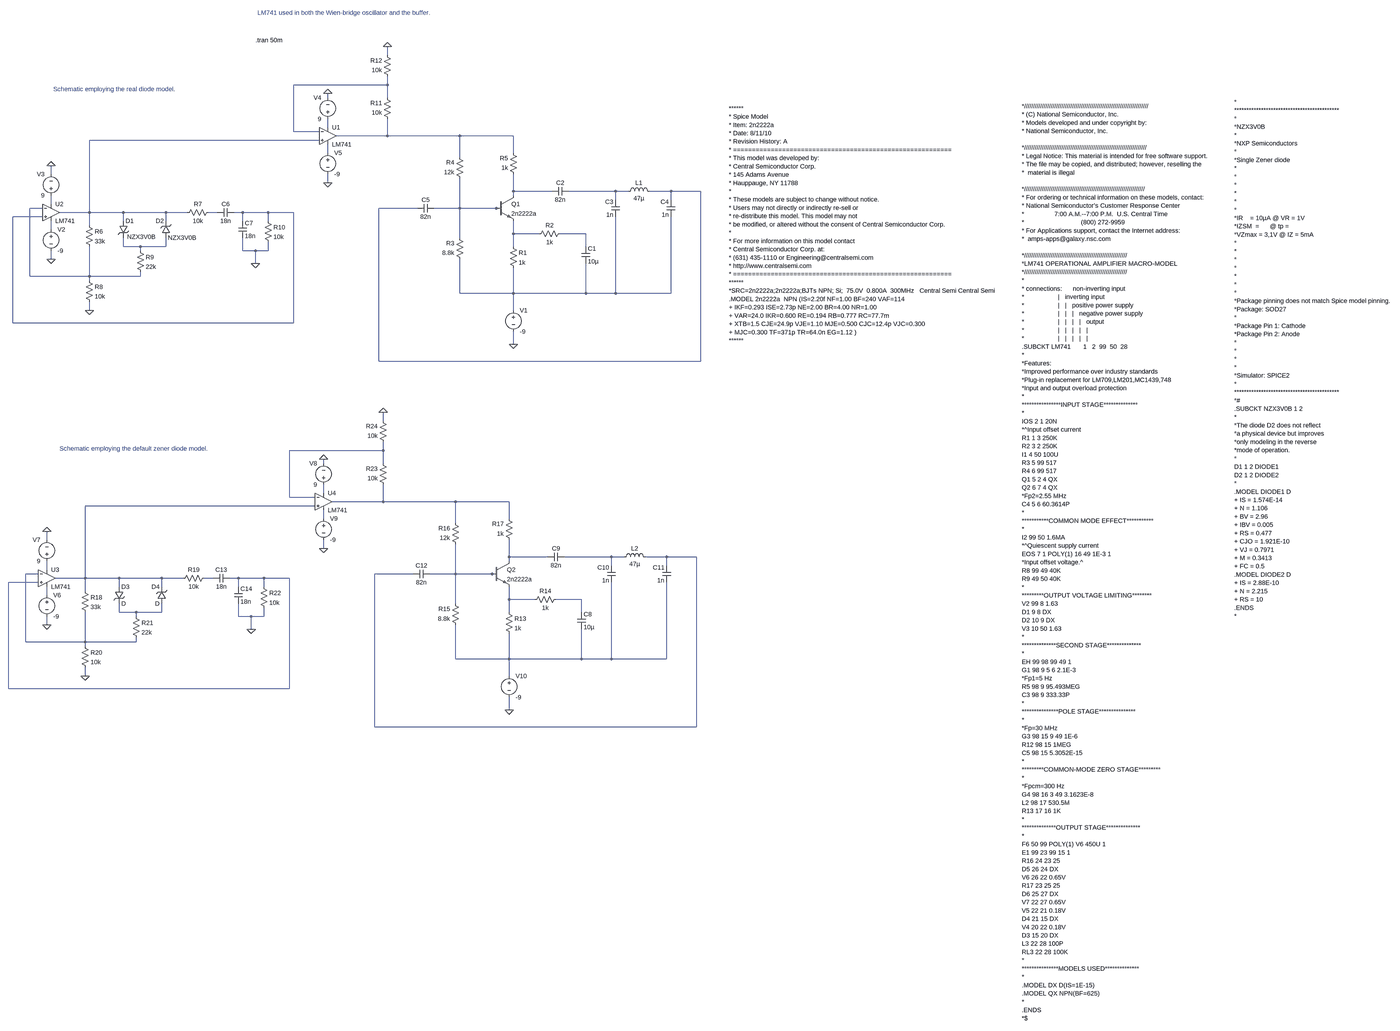
[diagram p0: schematic modulator.asc, whole sheet]
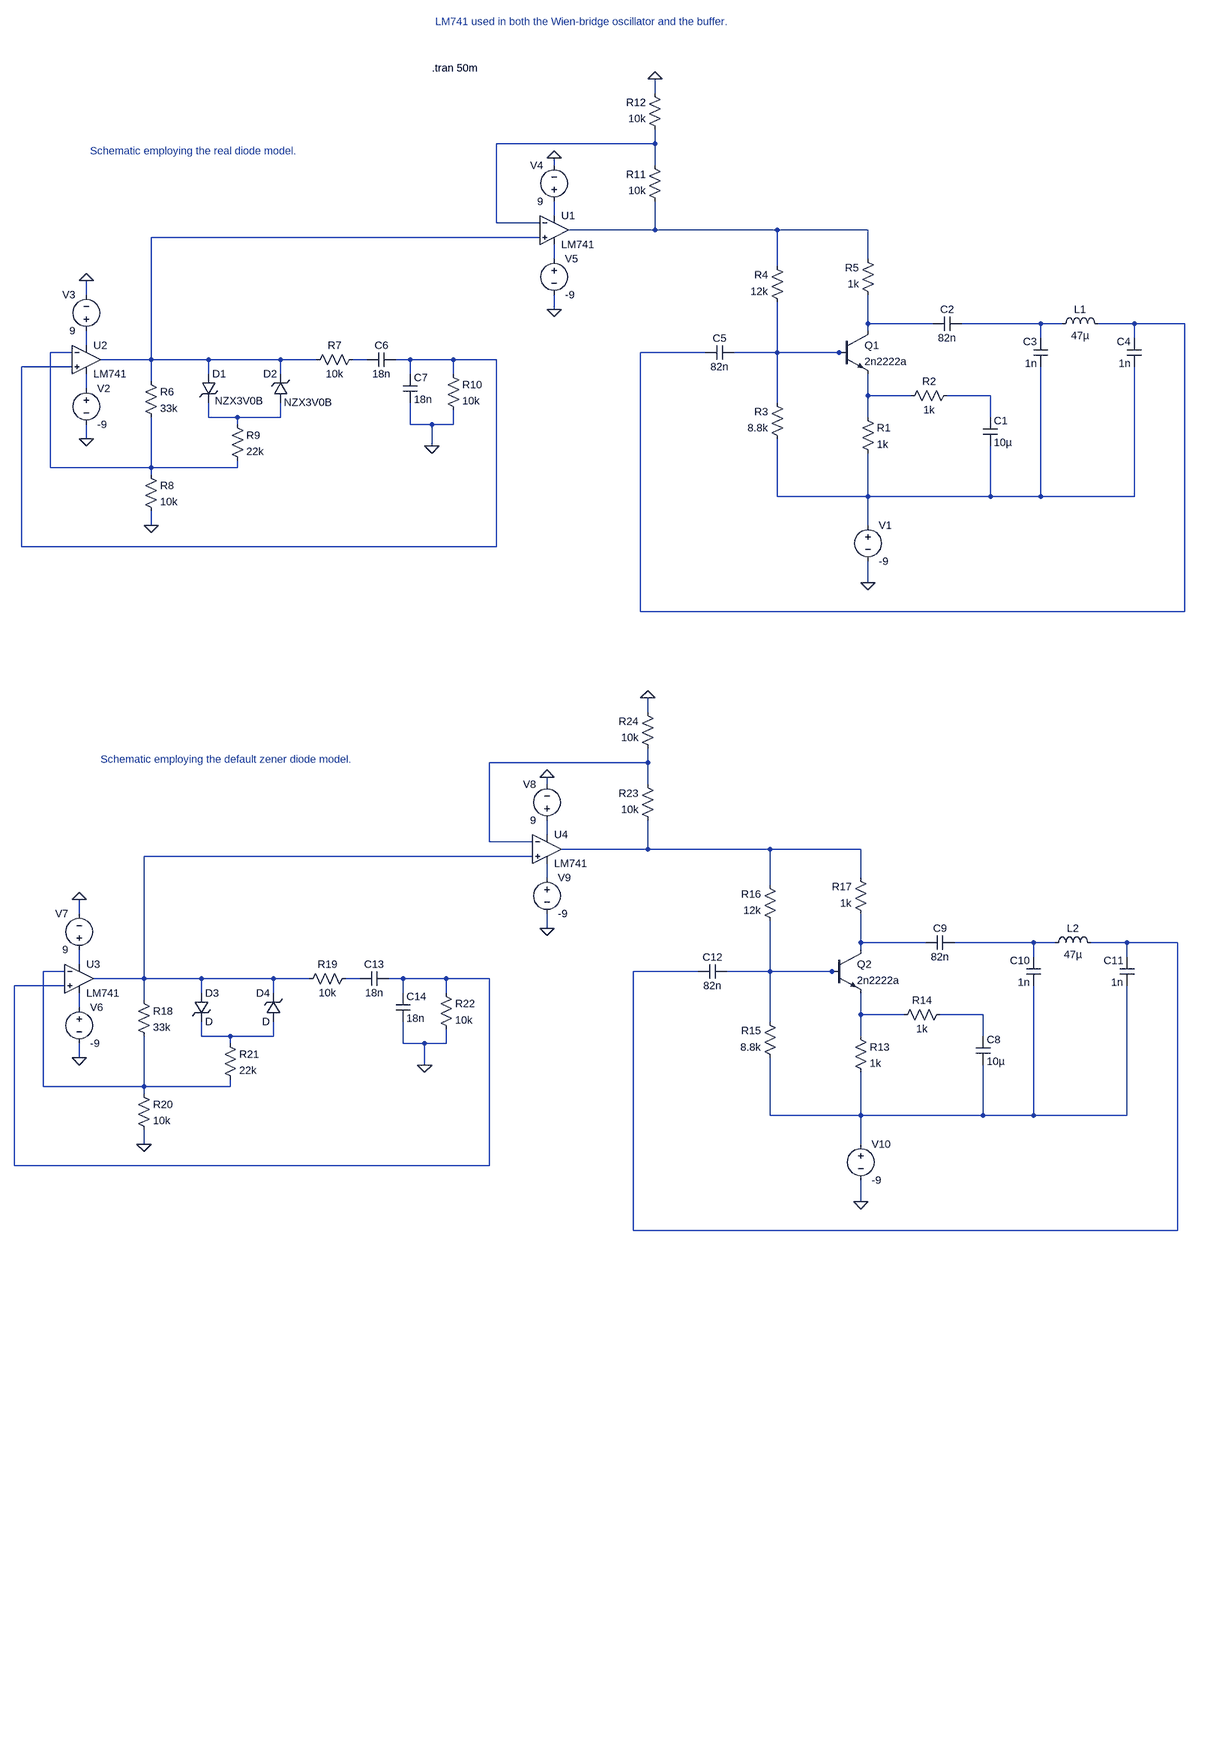
[diagram p1: schematic modulator.asc, part, row 1 of 1, column 1 of 2]
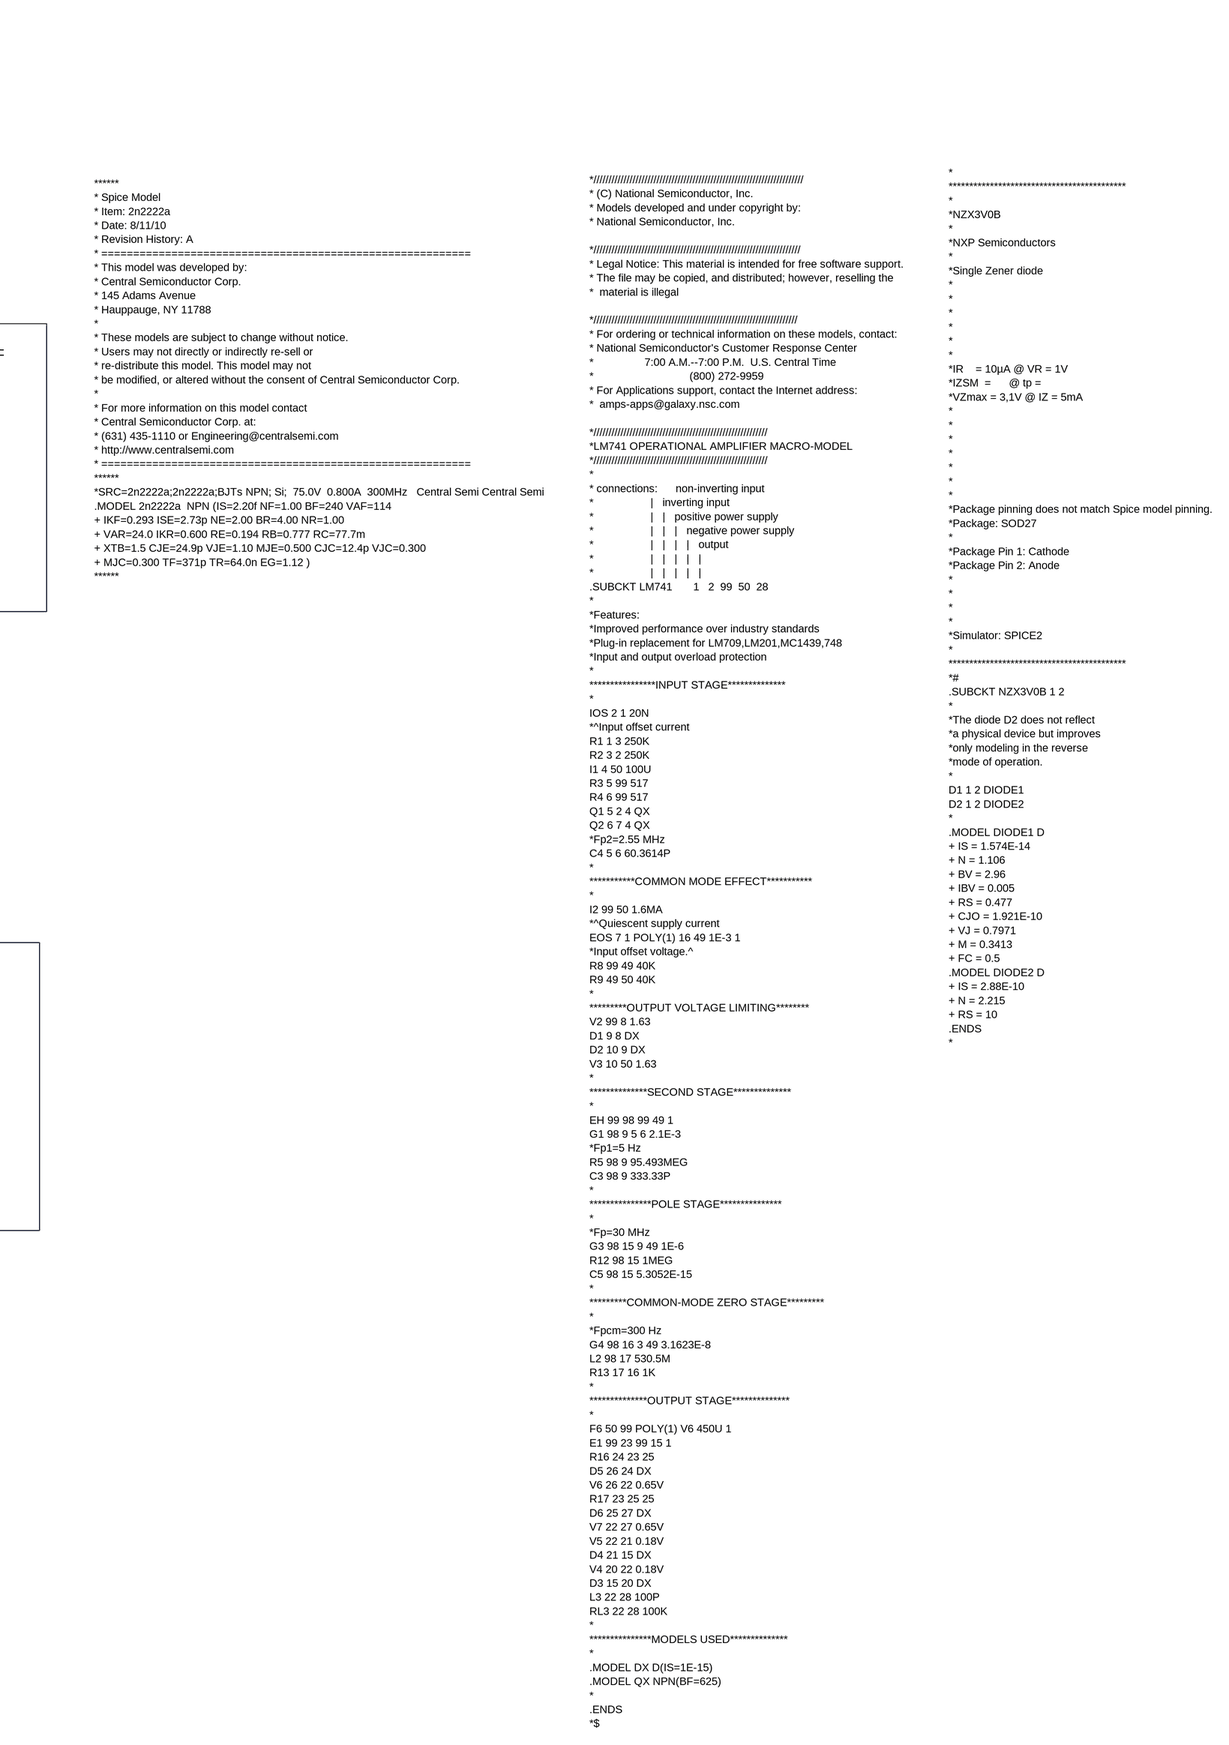
[diagram p2: schematic modulator.asc, part, row 1 of 1, column 2 of 2]
modulator.asc, the LTspice schematic file:
Version 4
SHEET 1 3220 3080
WIRE -1600 -208 -1600 -240
WIRE -1600 -96 -1600 -128
WIRE -1600 -96 -1952 -96
WIRE -1824 -48 -1824 -64
WIRE -1600 -48 -1600 -96
WIRE -1824 64 -1824 32
WIRE -1952 80 -1952 -96
WIRE -1856 80 -1952 80
WIRE -1600 96 -1600 32
WIRE -1600 96 -1792 96
WIRE -1328 96 -1600 96
WIRE -1088 96 -1328 96
WIRE -1856 112 -2720 112
WIRE -1824 160 -1824 128
WIRE -1088 160 -1088 96
WIRE -1328 176 -1328 96
WIRE -2864 240 -2864 208
WIRE -1824 272 -1824 240
WIRE -1088 304 -1088 240
WIRE -944 304 -1088 304
WIRE -704 304 -880 304
WIRE -656 304 -704 304
WIRE -496 304 -576 304
WIRE -384 304 -496 304
WIRE -1088 320 -1088 304
WIRE -704 336 -704 304
WIRE -496 336 -496 304
WIRE -2864 352 -2864 320
WIRE -2896 368 -2944 368
WIRE -1488 368 -1632 368
WIRE -1328 368 -1328 256
WIRE -1328 368 -1424 368
WIRE -1152 368 -1328 368
WIRE -1136 368 -1152 368
WIRE -2720 384 -2720 112
WIRE -2720 384 -2832 384
WIRE -2592 384 -2720 384
WIRE -2432 384 -2592 384
WIRE -2352 384 -2432 384
WIRE -2240 384 -2272 384
WIRE -2144 384 -2176 384
WIRE -2048 384 -2144 384
WIRE -1952 384 -2048 384
WIRE -2896 400 -3008 400
WIRE -2592 416 -2592 384
WIRE -2432 416 -2432 384
WIRE -2144 416 -2144 384
WIRE -2048 416 -2048 384
WIRE -2720 432 -2720 384
WIRE -2864 448 -2864 416
WIRE -1088 464 -1088 416
WIRE -992 464 -1088 464
WIRE -816 464 -912 464
WIRE -1328 480 -1328 368
WIRE -2592 512 -2592 480
WIRE -2528 512 -2592 512
WIRE -2432 512 -2432 480
WIRE -2432 512 -2528 512
WIRE -1088 512 -1088 464
WIRE -816 512 -816 464
WIRE -2528 528 -2528 512
WIRE -2144 528 -2144 480
WIRE -2096 528 -2144 528
WIRE -2048 528 -2048 496
WIRE -2048 528 -2096 528
WIRE -2864 560 -2864 528
WIRE -2096 576 -2096 528
WIRE -2944 624 -2944 368
WIRE -2720 624 -2720 512
WIRE -2720 624 -2944 624
WIRE -2528 624 -2528 608
WIRE -2528 624 -2720 624
WIRE -2720 640 -2720 624
WIRE -1328 688 -1328 560
WIRE -1088 688 -1088 592
WIRE -1088 688 -1328 688
WIRE -816 688 -816 576
WIRE -816 688 -1088 688
WIRE -704 688 -704 400
WIRE -704 688 -816 688
WIRE -496 688 -496 400
WIRE -496 688 -704 688
WIRE -2720 752 -2720 720
WIRE -1088 752 -1088 688
WIRE -3008 800 -3008 400
WIRE -1952 800 -1952 384
WIRE -1952 800 -3008 800
WIRE -1088 880 -1088 832
WIRE -1632 944 -1632 368
WIRE -384 944 -384 304
WIRE -384 944 -1632 944
WIRE -1616 1168 -1616 1136
WIRE -1616 1280 -1616 1248
WIRE -1616 1280 -1968 1280
WIRE -1840 1328 -1840 1312
WIRE -1616 1328 -1616 1280
WIRE -1840 1440 -1840 1408
WIRE -1968 1456 -1968 1280
WIRE -1872 1456 -1968 1456
WIRE -1616 1472 -1616 1408
WIRE -1616 1472 -1808 1472
WIRE -1344 1472 -1616 1472
WIRE -1104 1472 -1344 1472
WIRE -1872 1488 -2736 1488
WIRE -1840 1536 -1840 1504
WIRE -1104 1536 -1104 1472
WIRE -1344 1552 -1344 1472
WIRE -2880 1616 -2880 1584
WIRE -1840 1648 -1840 1616
WIRE -1104 1680 -1104 1616
WIRE -960 1680 -1104 1680
WIRE -720 1680 -896 1680
WIRE -672 1680 -720 1680
WIRE -512 1680 -592 1680
WIRE -400 1680 -512 1680
WIRE -1104 1696 -1104 1680
WIRE -720 1712 -720 1680
WIRE -512 1712 -512 1680
WIRE -2880 1728 -2880 1696
WIRE -2912 1744 -2960 1744
WIRE -1504 1744 -1648 1744
WIRE -1344 1744 -1344 1632
WIRE -1344 1744 -1440 1744
WIRE -1168 1744 -1344 1744
WIRE -1152 1744 -1168 1744
WIRE -2736 1760 -2736 1488
WIRE -2736 1760 -2848 1760
WIRE -2608 1760 -2736 1760
WIRE -2448 1760 -2608 1760
WIRE -2368 1760 -2448 1760
WIRE -2256 1760 -2288 1760
WIRE -2160 1760 -2192 1760
WIRE -2064 1760 -2160 1760
WIRE -1968 1760 -2064 1760
WIRE -2912 1776 -3024 1776
WIRE -2608 1792 -2608 1760
WIRE -2448 1792 -2448 1760
WIRE -2160 1792 -2160 1760
WIRE -2064 1792 -2064 1760
WIRE -2736 1808 -2736 1760
WIRE -2880 1824 -2880 1792
WIRE -1104 1840 -1104 1792
WIRE -1008 1840 -1104 1840
WIRE -832 1840 -928 1840
WIRE -1344 1856 -1344 1744
WIRE -2608 1888 -2608 1856
WIRE -2544 1888 -2608 1888
WIRE -2448 1888 -2448 1856
WIRE -2448 1888 -2544 1888
WIRE -1104 1888 -1104 1840
WIRE -832 1888 -832 1840
WIRE -2544 1904 -2544 1888
WIRE -2160 1904 -2160 1856
WIRE -2112 1904 -2160 1904
WIRE -2064 1904 -2064 1872
WIRE -2064 1904 -2112 1904
WIRE -2880 1936 -2880 1904
WIRE -2112 1952 -2112 1904
WIRE -2960 2000 -2960 1744
WIRE -2736 2000 -2736 1888
WIRE -2736 2000 -2960 2000
WIRE -2544 2000 -2544 1984
WIRE -2544 2000 -2736 2000
WIRE -2736 2016 -2736 2000
WIRE -1344 2064 -1344 1936
WIRE -1104 2064 -1104 1968
WIRE -1104 2064 -1344 2064
WIRE -832 2064 -832 1952
WIRE -832 2064 -1104 2064
WIRE -720 2064 -720 1776
WIRE -720 2064 -832 2064
WIRE -512 2064 -512 1776
WIRE -512 2064 -720 2064
WIRE -2736 2128 -2736 2096
WIRE -1104 2128 -1104 2064
WIRE -3024 2176 -3024 1776
WIRE -1968 2176 -1968 1760
WIRE -1968 2176 -3024 2176
WIRE -1104 2256 -1104 2208
WIRE -1648 2320 -1648 1744
WIRE -400 2320 -400 1680
WIRE -400 2320 -1648 2320
FLAG -2720 752 0
FLAG -2096 576 0
FLAG -2864 560 0
FLAG -2864 208 0
FLAG -1600 -240 0
FLAG -1824 -64 0
FLAG -1824 272 0
FLAG -1088 880 0
FLAG -2736 2128 0
FLAG -2112 1952 0
FLAG -2880 1936 0
FLAG -2880 1584 0
FLAG -1616 1136 0
FLAG -1840 1312 0
FLAG -1840 1648 0
FLAG -1104 2256 0
SYMBOL npn -1152 320 R0
SYMATTR InstName Q1
SYMATTR Value 2n2222a
SYMBOL res -1104 496 R0
SYMATTR InstName R1
SYMATTR Value 1k
SYMBOL res -896 448 R90
WINDOW 0 0 56 VBottom 2
WINDOW 3 32 56 VTop 2
SYMATTR InstName R2
SYMATTR Value 1k
SYMBOL res -1312 576 R180
WINDOW 0 36 76 Left 2
WINDOW 3 36 40 Left 2
SYMATTR InstName R3
SYMATTR Value 8.8k
SYMBOL res -1312 272 R180
WINDOW 0 36 76 Left 2
WINDOW 3 36 40 Left 2
SYMATTR InstName R4
SYMATTR Value 12k
SYMBOL res -1072 256 R180
WINDOW 0 36 76 Left 2
WINDOW 3 36 40 Left 2
SYMATTR InstName R5
SYMATTR Value 1k
SYMBOL cap -832 512 R0
SYMATTR InstName C1
SYMATTR Value 10µ
SYMBOL cap -880 288 R90
WINDOW 0 0 32 VBottom 2
WINDOW 3 32 32 VTop 2
SYMATTR InstName C2
SYMATTR Value 82n
SYMBOL cap -688 400 R180
WINDOW 0 24 56 Left 2
WINDOW 3 24 8 Left 2
SYMATTR InstName C3
SYMATTR Value 1n
SYMBOL cap -480 400 R180
WINDOW 0 24 56 Left 2
WINDOW 3 24 8 Left 2
SYMATTR InstName C4
SYMATTR Value 1n
SYMBOL cap -1488 384 R270
WINDOW 0 32 32 VTop 2
WINDOW 3 0 32 VBottom 2
SYMATTR InstName C5
SYMATTR Value 82n
SYMBOL ind -672 320 R270
WINDOW 0 32 56 VTop 2
WINDOW 3 5 56 VBottom 2
SYMATTR InstName L1
SYMATTR Value 47µ
SYMBOL OpAmps\\opamp2 -2864 320 R0
SYMATTR InstName U2
SYMATTR Value LM741
SYMBOL res -2736 416 R0
SYMATTR InstName R6
SYMATTR Value 33k
SYMBOL res -2256 368 R90
WINDOW 0 0 56 VBottom 2
WINDOW 3 32 56 VTop 2
SYMATTR InstName R7
SYMATTR Value 10k
SYMBOL res -2736 624 R0
SYMATTR InstName R8
SYMATTR Value 10k
SYMBOL res -2544 512 R0
SYMATTR InstName R9
SYMATTR Value 22k
SYMBOL zener -2608 416 R0
WINDOW 3 30 60 Left 2
SYMATTR InstName D1
SYMATTR Value NZX3V0B
SYMATTR Prefix X
SYMBOL zener -2416 480 R180
WINDOW 0 24 64 Left 2
WINDOW 3 -98 1 Left 2
SYMATTR InstName D2
SYMATTR Value NZX3V0B
SYMATTR Prefix X
SYMBOL cap -2176 368 R90
WINDOW 0 0 32 VBottom 2
WINDOW 3 32 32 VTop 2
SYMATTR InstName C6
SYMATTR Value 18n
SYMBOL cap -2160 416 R0
SYMATTR InstName C7
SYMATTR Value 18n
SYMBOL res -2064 400 R0
SYMATTR InstName R10
SYMATTR Value 10k
SYMBOL voltage -2864 432 R0
SYMATTR InstName V2
SYMATTR Value -9
SYMBOL voltage -2864 336 R180
WINDOW 0 24 96 Left 2
WINDOW 3 24 16 Left 2
SYMATTR InstName V3
SYMATTR Value 9
SYMBOL OpAmps\\opamp2 -1824 32 R0
SYMATTR InstName U1
SYMATTR Value LM741
SYMBOL res -1584 48 R180
WINDOW 0 36 76 Left 2
WINDOW 3 36 40 Left 2
SYMATTR InstName R11
SYMATTR Value 10k
SYMBOL res -1584 -112 R180
WINDOW 0 36 76 Left 2
WINDOW 3 36 40 Left 2
SYMATTR InstName R12
SYMATTR Value 10k
SYMBOL voltage -1824 48 R180
WINDOW 0 24 96 Left 2
WINDOW 3 24 16 Left 2
SYMATTR InstName V4
SYMATTR Value 9
SYMBOL voltage -1824 144 R0
SYMATTR InstName V5
SYMATTR Value -9
SYMBOL voltage -1088 736 R0
SYMATTR InstName V1
SYMATTR Value -9
SYMBOL npn -1168 1696 R0
SYMATTR InstName Q2
SYMATTR Value 2n2222a
SYMBOL res -1120 1872 R0
SYMATTR InstName R13
SYMATTR Value 1k
SYMBOL res -912 1824 R90
WINDOW 0 0 56 VBottom 2
WINDOW 3 32 56 VTop 2
SYMATTR InstName R14
SYMATTR Value 1k
SYMBOL res -1328 1952 R180
WINDOW 0 36 76 Left 2
WINDOW 3 36 40 Left 2
SYMATTR InstName R15
SYMATTR Value 8.8k
SYMBOL res -1328 1648 R180
WINDOW 0 36 76 Left 2
WINDOW 3 36 40 Left 2
SYMATTR InstName R16
SYMATTR Value 12k
SYMBOL res -1088 1632 R180
WINDOW 0 36 76 Left 2
WINDOW 3 36 40 Left 2
SYMATTR InstName R17
SYMATTR Value 1k
SYMBOL cap -848 1888 R0
SYMATTR InstName C8
SYMATTR Value 10µ
SYMBOL cap -896 1664 R90
WINDOW 0 0 32 VBottom 2
WINDOW 3 32 32 VTop 2
SYMATTR InstName C9
SYMATTR Value 82n
SYMBOL cap -704 1776 R180
WINDOW 0 24 56 Left 2
WINDOW 3 24 8 Left 2
SYMATTR InstName C10
SYMATTR Value 1n
SYMBOL cap -496 1776 R180
WINDOW 0 24 56 Left 2
WINDOW 3 24 8 Left 2
SYMATTR InstName C11
SYMATTR Value 1n
SYMBOL cap -1504 1760 R270
WINDOW 0 32 32 VTop 2
WINDOW 3 0 32 VBottom 2
SYMATTR InstName C12
SYMATTR Value 82n
SYMBOL ind -688 1696 R270
WINDOW 0 32 56 VTop 2
WINDOW 3 5 56 VBottom 2
SYMATTR InstName L2
SYMATTR Value 47µ
SYMBOL OpAmps\\opamp2 -2880 1696 R0
SYMATTR InstName U3
SYMATTR Value LM741
SYMBOL res -2752 1792 R0
SYMATTR InstName R18
SYMATTR Value 33k
SYMBOL res -2272 1744 R90
WINDOW 0 0 56 VBottom 2
WINDOW 3 32 56 VTop 2
SYMATTR InstName R19
SYMATTR Value 10k
SYMBOL res -2752 2000 R0
SYMATTR InstName R20
SYMATTR Value 10k
SYMBOL res -2560 1888 R0
SYMATTR InstName R21
SYMATTR Value 22k
SYMBOL cap -2192 1744 R90
WINDOW 0 0 32 VBottom 2
WINDOW 3 32 32 VTop 2
SYMATTR InstName C13
SYMATTR Value 18n
SYMBOL cap -2176 1792 R0
SYMATTR InstName C14
SYMATTR Value 18n
SYMBOL res -2080 1776 R0
SYMATTR InstName R22
SYMATTR Value 10k
SYMBOL voltage -2880 1808 R0
SYMATTR InstName V6
SYMATTR Value -9
SYMBOL voltage -2880 1712 R180
WINDOW 0 24 96 Left 2
WINDOW 3 24 16 Left 2
SYMATTR InstName V7
SYMATTR Value 9
SYMBOL OpAmps\\opamp2 -1840 1408 R0
SYMATTR InstName U4
SYMATTR Value LM741
SYMBOL res -1600 1424 R180
WINDOW 0 36 76 Left 2
WINDOW 3 36 40 Left 2
SYMATTR InstName R23
SYMATTR Value 10k
SYMBOL res -1600 1264 R180
WINDOW 0 36 76 Left 2
WINDOW 3 36 40 Left 2
SYMATTR InstName R24
SYMATTR Value 10k
SYMBOL voltage -1840 1424 R180
WINDOW 0 24 96 Left 2
WINDOW 3 24 16 Left 2
SYMATTR InstName V8
SYMATTR Value 9
SYMBOL voltage -1840 1520 R0
SYMATTR InstName V9
SYMATTR Value -9
SYMBOL voltage -1104 2112 R0
SYMATTR InstName V10
SYMATTR Value -9
SYMBOL zener -2624 1792 R0
SYMATTR InstName D3
SYMBOL zener -2432 1856 R180
WINDOW 0 24 64 Left 2
WINDOW 3 24 0 Left 2
SYMATTR InstName D4
TEXT 320 -8 Left 2 !******\n* Spice Model\n* Item: 2n2222a\n* Date: 8/11/10\n* Revision History: A\n* ==========================================================\n* This model was developed by: \n* Central Semiconductor Corp.\n* 145 Adams Avenue\n* Hauppauge, NY 11788\n*\n* These models are subject to change without notice.\n* Users may not directly or indirectly re-sell or \n* re-distribute this model. This model may not \n* be modified, or altered without the consent of Central Semiconductor Corp. \n*\n* For more information on this model contact\n* Central Semiconductor Corp. at:\n* (631) 435-1110 or Engineering@centralsemi.com\n* http://www.centralsemi.com\n* ==========================================================\n******\n*SRC=2n2222a;2n2222a;BJTs NPN; Si;  75.0V  0.800A  300MHz   Central Semi Central Semi\n.MODEL 2n2222a  NPN (IS=2.20f NF=1.00 BF=240 VAF=114\n+ IKF=0.293 ISE=2.73p NE=2.00 BR=4.00 NR=1.00\n+ VAR=24.0 IKR=0.600 RE=0.194 RB=0.777 RC=77.7m\n+ XTB=1.5 CJE=24.9p VJE=1.10 MJE=0.500 CJC=12.4p VJC=0.300\n+ MJC=0.300 TF=371p TR=64.0n EG=1.12 )\n******
TEXT 1536 -16 Left 2 !*//////////////////////////////////////////////////////////////////////\n* (C) National Semiconductor, Inc.\n* Models developed and under copyright by:\n* National Semiconductor, Inc.  \n \n*/////////////////////////////////////////////////////////////////////\n* Legal Notice: This material is intended for free software support.\n* The file may be copied, and distributed; however, reselling the \n*  material is illegal\n \n*////////////////////////////////////////////////////////////////////\n* For ordering or technical information on these models, contact:\n* National Semiconductor's Customer Response Center\n*                 7:00 A.M.--7:00 P.M.  U.S. Central Time\n*                                (800) 272-9959\n* For Applications support, contact the Internet address:\n*  amps-apps@galaxy.nsc.com\n \n*//////////////////////////////////////////////////////////\n*LM741 OPERATIONAL AMPLIFIER MACRO-MODEL\n*//////////////////////////////////////////////////////////\n*\n* connections:      non-inverting input\n*                   |   inverting input\n*                   |   |   positive power supply\n*                   |   |   |   negative power supply\n*                   |   |   |   |   output\n*                   |   |   |   |   |\n*                   |   |   |   |   |\n.SUBCKT LM741       1   2  99  50  28\n*\n*Features:\n*Improved performance over industry standards\n*Plug-in replacement for LM709,LM201,MC1439,748\n*Input and output overload protection\n*\n****************INPUT STAGE**************\n*\nIOS 2 1 20N\n*^Input offset current\nR1 1 3 250K\nR2 3 2 250K\nI1 4 50 100U\nR3 5 99 517\nR4 6 99 517\nQ1 5 2 4 QX\nQ2 6 7 4 QX\n*Fp2=2.55 MHz\nC4 5 6 60.3614P\n*\n***********COMMON MODE EFFECT***********\n*\nI2 99 50 1.6MA\n*^Quiescent supply current\nEOS 7 1 POLY(1) 16 49 1E-3 1\n*Input offset voltage.^\nR8 99 49 40K\nR9 49 50 40K\n*\n*********OUTPUT VOLTAGE LIMITING********\nV2 99 8 1.63\nD1 9 8 DX\nD2 10 9 DX\nV3 10 50 1.63\n*\n**************SECOND STAGE**************\n*\nEH 99 98 99 49 1\nG1 98 9 5 6 2.1E-3\n*Fp1=5 Hz\nR5 98 9 95.493MEG\nC3 98 9 333.33P\n*\n***************POLE STAGE***************\n*\n*Fp=30 MHz\nG3 98 15 9 49 1E-6\nR12 98 15 1MEG\nC5 98 15 5.3052E-15\n*\n*********COMMON-MODE ZERO STAGE*********\n*\n*Fpcm=300 Hz\nG4 98 16 3 49 3.1623E-8\nL2 98 17 530.5M\nR13 17 16 1K\n*\n**************OUTPUT STAGE**************\n*\nF6 50 99 POLY(1) V6 450U 1\nE1 99 23 99 15 1\nR16 24 23 25\nD5 26 24 DX\nV6 26 22 0.65V\nR17 23 25 25\nD6 25 27 DX\nV7 22 27 0.65V\nV5 22 21 0.18V\nD4 21 15 DX\nV4 20 22 0.18V\nD3 15 20 DX\nL3 22 28 100P\nRL3 22 28 100K\n*\n***************MODELS USED**************\n*\n.MODEL DX D(IS=1E-15)\n.MODEL QX NPN(BF=625)\n*\n.ENDS\n*$
TEXT -2088 -368 Left 2 ;LM741 used in both the Wien-bridge oscillator and the buffer.
TEXT -2096 -264 Left 2 !.tran 50m
TEXT 2576 -32 Left 2 !*\n*******************************************\n*\n*NZX3V0B\n*\n*NXP Semiconductors\n*\n*Single Zener diode\n*\n*\n*\n*\n* \n*\n*IR    = 10µA @ VR = 1V\n*IZSM  =      @ tp = \n*VZmax = 3,1V @ IZ = 5mA\n*\n*\n*\n*\n* \n*\n*\n*Package pinning does not match Spice model pinning.\n*Package: SOD27\n*\n*Package Pin 1: Cathode\n*Package Pin 2: Anode\n*\n*\n*\n*\n*Simulator: SPICE2\n*\n*******************************************\n*#\n.SUBCKT NZX3V0B 1 2 \n*\n*The diode D2 does not reflect \n*a physical device but improves \n*only modeling in the reverse \n*mode of operation.\n*\nD1 1 2 DIODE1\nD2 1 2 DIODE2 \n*\n.MODEL DIODE1 D \n+ IS = 1.574E-14 \n+ N = 1.106 \n+ BV = 2.96 \n+ IBV = 0.005 \n+ RS = 0.477 \n+ CJO = 1.921E-10 \n+ VJ = 0.7971 \n+ M = 0.3413 \n+ FC = 0.5 \n.MODEL DIODE2 D \n+ IS = 2.88E-10 \n+ N = 2.215 \n+ RS = 10 \n.ENDS\n*
TEXT -2856 -80 Left 2 ;Schematic employing the real diode model.
TEXT -2832 1272 Left 2 ;Schematic employing the default zener diode model.

The netlist it stands for:
* modulator.asc
Q1 N006 N011 N015 0 2n2222a
R1 N015 N018 1k
R2 N016 N015 1k
R3 N018 N011 8.8k
R4 N011 N003 12k
R5 N006 N003 1k
C1 N016 N018 10µ
C2 N007 N006 82n
C3 N018 N007 1n
C4 N018 N008 1n
C5 N008 N011 82n
L1 N007 N008 47µ
XU2 N013 N010 N009 N014 N004 LM741  ; pins In+ In- V+ V- OUT
R6 N004 N010 33k
R7 N012 N004 10k
R8 N010 0 10k
R9 N017 N010 22k
XD1 N004 N017 NZX3V0B  ; pins + -
XD2 N017 N004 NZX3V0B  ; pins + -
C6 N013 N012 18n
C7 N013 0 18n
R10 N013 0 10k
V2 N014 0 -9
V3 N009 0 9
XU1 N004 N001 N002 N005 N003 LM741  ; pins In+ In- V+ V- OUT
R11 N003 N001 10k
R12 N001 0 10k
V4 N002 0 9
V5 N005 0 -9
V1 N018 0 -9
Q2 N024 N029 N033 0 2n2222a
R13 N033 N036 1k
R14 N034 N033 1k
R15 N036 N029 8.8k
R16 N029 N021 12k
R17 N024 N021 1k
C8 N034 N036 10µ
C9 N025 N024 82n
C10 N036 N025 1n
C11 N036 N026 1n
C12 N026 N029 82n
L2 N025 N026 47µ
XU3 N031 N028 N027 N032 N022 LM741  ; pins In+ In- V+ V- OUT
R18 N022 N028 33k
R19 N030 N022 10k
R20 N028 0 10k
R21 N035 N028 22k
C13 N031 N030 18n
C14 N031 0 18n
R22 N031 0 10k
V6 N032 0 -9
V7 N027 0 9
XU4 N022 N019 N020 N023 N021 LM741  ; pins In+ In- V+ V- OUT
R23 N021 N019 10k
R24 N019 0 10k
V8 N020 0 9
V9 N023 0 -9
V10 N036 0 -9
D3 N022 N035 D
D4 N035 N022 D
.model D D
.lib standard.dio
.model NPN NPN
.model PNP PNP
.lib standard.bjt
******
* Spice Model
* Item: 2n2222a
* Date: 8/11/10
* Revision History: A
* ==========================================================
* This model was developed by:
* Central Semiconductor Corp.
* 145 Adams Avenue
* Hauppauge, NY 11788
*
* These models are subject to change without notice.
* Users may not directly or indirectly re-sell or
* re-distribute this model. This model may not
* be modified, or altered without the consent of Central Semiconductor Corp.
*
* For more information on this model contact
* Central Semiconductor Corp. at:
* (631) 435-1110 or Engineering@centralsemi.com
* http://www.centralsemi.com
* ==========================================================
******
*SRC=2n2222a;2n2222a;BJTs NPN; Si;  75.0V  0.800A  300MHz   Central Semi Central Semi
.MODEL 2n2222a  NPN (IS=2.20f NF=1.00 BF=240 VAF=114
+ IKF=0.293 ISE=2.73p NE=2.00 BR=4.00 NR=1.00
+ VAR=24.0 IKR=0.600 RE=0.194 RB=0.777 RC=77.7m
+ XTB=1.5 CJE=24.9p VJE=1.10 MJE=0.500 CJC=12.4p VJC=0.300
+ MJC=0.300 TF=371p TR=64.0n EG=1.12 )
******
*//////////////////////////////////////////////////////////////////////
* (C) National Semiconductor, Inc.
* Models developed and under copyright by:
* National Semiconductor, Inc.
*/////////////////////////////////////////////////////////////////////
* Legal Notice: This material is intended for free software support.
* The file may be copied, and distributed; however, reselling the
*  material is illegal
*////////////////////////////////////////////////////////////////////
* For ordering or technical information on these models, contact:
* National Semiconductor's Customer Response Center
*                 7:00 A.M.--7:00 P.M.  U.S. Central Time
*                                (800) 272-9959
* For Applications support, contact the Internet address:
*  amps-apps@galaxy.nsc.com
*//////////////////////////////////////////////////////////
*LM741 OPERATIONAL AMPLIFIER MACRO-MODEL
*//////////////////////////////////////////////////////////
*
* connections:      non-inverting input
*                   |   inverting input
*                   |   |   positive power supply
*                   |   |   |   negative power supply
*                   |   |   |   |   output
*                   |   |   |   |   |
*                   |   |   |   |   |
.SUBCKT LM741       1   2  99  50  28
*
*Features:
*Improved performance over industry standards
*Plug-in replacement for LM709,LM201,MC1439,748
*Input and output overload protection
*
****************INPUT STAGE**************
*
IOS 2 1 20N
*^Input offset current
R1 1 3 250K
R2 3 2 250K
I1 4 50 100U
R3 5 99 517
R4 6 99 517
Q1 5 2 4 QX
Q2 6 7 4 QX
*Fp2=2.55 MHz
C4 5 6 60.3614P
*
***********COMMON MODE EFFECT***********
*
I2 99 50 1.6MA
*^Quiescent supply current
EOS 7 1 POLY(1) 16 49 1E-3 1
*Input offset voltage.^
R8 99 49 40K
R9 49 50 40K
*
*********OUTPUT VOLTAGE LIMITING********
V2 99 8 1.63
D1 9 8 DX
D2 10 9 DX
V3 10 50 1.63
*
**************SECOND STAGE**************
*
EH 99 98 99 49 1
G1 98 9 5 6 2.1E-3
*Fp1=5 Hz
R5 98 9 95.493MEG
C3 98 9 333.33P
*
***************POLE STAGE***************
*
*Fp=30 MHz
G3 98 15 9 49 1E-6
R12 98 15 1MEG
C5 98 15 5.3052E-15
*
*********COMMON-MODE ZERO STAGE*********
*
*Fpcm=300 Hz
G4 98 16 3 49 3.1623E-8
L2 98 17 530.5M
R13 17 16 1K
*
**************OUTPUT STAGE**************
*
F6 50 99 POLY(1) V6 450U 1
E1 99 23 99 15 1
R16 24 23 25
D5 26 24 DX
V6 26 22 0.65V
R17 23 25 25
D6 25 27 DX
V7 22 27 0.65V
V5 22 21 0.18V
D4 21 15 DX
V4 20 22 0.18V
D3 15 20 DX
L3 22 28 100P
RL3 22 28 100K
*
***************MODELS USED**************
*
.MODEL DX D(IS=1E-15)
.MODEL QX NPN(BF=625)
*
.ENDS
*$
* LM741 used in both the Wien-bridge oscillator and the buffer.
.tran 50m
*
*******************************************
*
*NZX3V0B
*
*NXP Semiconductors
*
*Single Zener diode
*
*
*
*
*
*
*IR    = 10µA @ VR = 1V
*IZSM  =      @ tp =
*VZmax = 3,1V @ IZ = 5mA
*
*
*
*
*
*
*
*Package pinning does not match Spice model pinning.
*Package: SOD27
*
*Package Pin 1: Cathode
*Package Pin 2: Anode
*
*
*
*
*Simulator: SPICE2
*
*******************************************
*#
.SUBCKT NZX3V0B 1 2
*
*The diode D2 does not reflect
*a physical device but improves
*only modeling in the reverse
*mode of operation.
*
D1 1 2 DIODE1
D2 1 2 DIODE2
*
.MODEL DIODE1 D
+ IS = 1.574E-14
+ N = 1.106
+ BV = 2.96
+ IBV = 0.005
+ RS = 0.477
+ CJO = 1.921E-10
+ VJ = 0.7971
+ M = 0.3413
+ FC = 0.5
.MODEL DIODE2 D
+ IS = 2.88E-10
+ N = 2.215
+ RS = 10
.ENDS
*
* Schematic employing the real diode model.
* Schematic employing the default zener diode model.
.backanno
.end